# Altium project phone_cover.PrjPcb
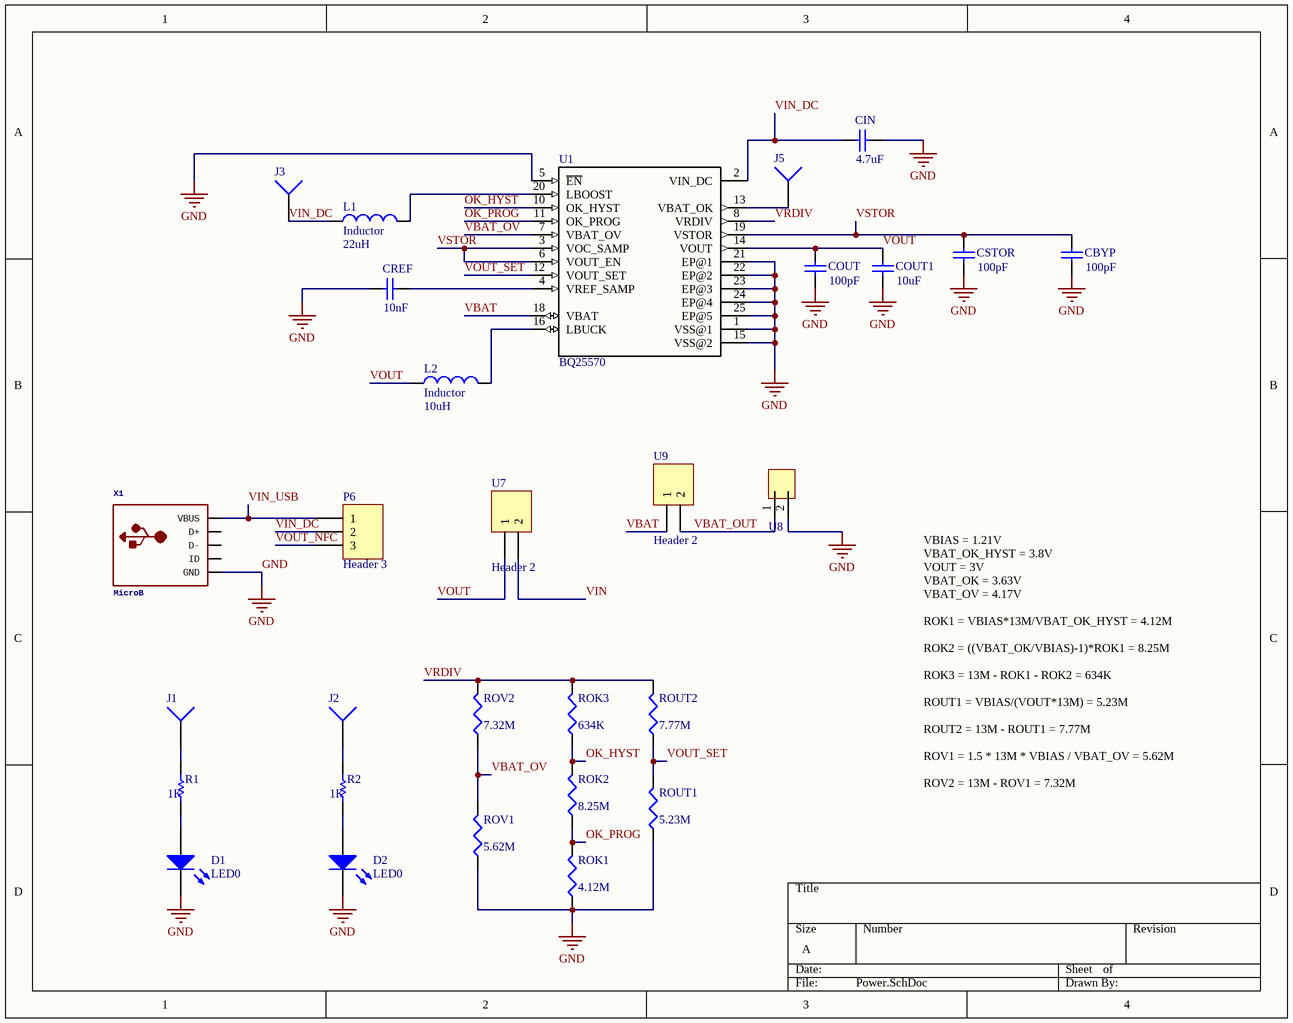
[diagram p0: Power.SchDoc]
3 sheets, 76 parts. Net scope: global (net labels, ports and power ports of the same name join across sheets).
Board file: phone_cover_layout.PcbDoc
Sheets:
  Power.SchDoc
  MCU.SchDoc
  Peripherals.SchDoc

## Sheet Power.SchDoc
size A

### Parts
CBYP  value 100pF  [C1206]  (hidden comment: Cap Semi)
CIN  value 4.7uF  [C1206]  (hidden comment: Cap Semi)
COUT  value 100pF  [C1206]  (hidden comment: Cap Semi)
COUT1  value 10uF  [C1206]  (hidden comment: Cap Semi)
CREF  value 10nF  [C1206]  (hidden comment: Cap Semi)
CSTOR  value 100pF  [C1206]  (hidden comment: Cap Semi)
D1  LED0  [LED-0]
D2  LED0  [LED-0]
J1  Socket  [PIN1]  (value not drawn)
J2  Socket  [PIN1]  (value not drawn)
J3  Socket  [PIN1]  (value not drawn)
J5  Socket  [PIN1]  (value not drawn)
L1  Inductor  value 22uH  [0402-A]
L2  Inductor  value 10uH  [0402-A]
P6  Header 3  [HDR1X3]
R1  value 1K  [AXIAL-0.3]  (hidden comment: Res1)
R2  value 1K  [AXIAL-0.3]  (hidden comment: Res1)
ROK1  value 4.12M  [J1-0603]  (hidden comment: Res3)
ROK2  value 8.25M  [J1-0603]  (hidden comment: Res3)
ROK3  value 634K  [J1-0603]  (hidden comment: Res3)
ROUT1  value 5.23M  [J1-0603]  (hidden comment: Res3)
ROUT2  value 7.77M  [J1-0603]  (hidden comment: Res3)
ROV1  value 5.62M  [J1-0603]  (hidden comment: Res3)
ROV2  value 7.32M  [J1-0603]  (hidden comment: Res3)
U1  BQ25570  [QFN50P350X350X100-21N]
U7  Header 2  [HDR1X2]
U8  JST_Conn  [JST]  (value not drawn)
U9  Header 2  [HDR1X2]
X1  MicroB  [629105150921]

### Nets
GND: CBYP.1 CIN.2 COUT.1 COUT1.1 CREF.1 CSTOR.1 D1.2(K) D2.2(K) ROK1.1 ROUT1.1 ROV1.1 U1.1(VSS@1) U1.5(~{EN}) U1.15(VSS@2) U1.21(EP@1) U1.22(EP@2) U1.23(EP@3) U1.24(EP@4) U1.25(EP@5) U8.2 X1.5(GND)
OK_HYST: ROK2.2 ROK3.1 U1.10(OK_HYST)
OK_PROG: ROK1.2 ROK2.1 U1.11(OK_PROG)
VBAT: U1.18(VBAT) U9.1
VBAT_OUT: U8.1 U9.2
VBAT_OV: ROV1.2 ROV2.1 U1.7(VBAT_OV)
VIN: U7.2  [project net IOVDD_0]
VIN_DC: CIN.1 J3.1 L1.1 P6.2 U1.2(VIN_DC)
VIN_USB: P6.1 X1.1(VBUS)
VOUT: COUT.2 COUT1.2 L2.1 U1.14(VOUT) U7.1
VOUT_NFC: P6.3
VOUT_SET: ROUT1.2 ROUT2.1 U1.12(VOUT_SET)
VRDIV: ROK3.2 ROUT2.2 ROV2.2 U1.8(VRDIV)
VSTOR: CBYP.2 CSTOR.2 U1.3(VOC_SAMP) U1.6(VOUT_EN) U1.19(VSTOR)
NetCREF_2: CREF.2 U1.4(VREF_SAMP)
NetD1_1: D1.1(A) R1.1
NetD2_1: D2.1(A) R2.1
NetJ1_1: J1.1 R1.2
NetJ2_1: J2.1 R2.2
NetJ5_1: J5.1 U1.13(VBAT_OK)
NetL1_2: L1.2 U1.20(LBOOST)
NetL2_2: L2.2 U1.16(LBUCK)

Not connected (* = marked no-connect by the designer): X1 2(D+) 3(D-) 4(ID)

### Notes on the sheet
- VBIAS = 1.21V
  VBAT_OK_HYST = 3.8V
  VOUT = 3V
  VBAT_OK = 3.63V
  VBAT_OV = 4.17V
  ROK1 = VBIAS*13M/VBAT_OK_HYST = 4.12M
  ROK2 = ((VBAT_OK/VBIAS)-1)*ROK1 = 8.25M
  ROK3 = 13M - ROK1 - ROK2 = 634K
  ROUT1 = VBIAS/(VOUT*13M) = 5.23M
  ROUT2 = 13M - ROUT1 = 7.77M
  ROV1 = 1.5 * 13M * VBIAS / VBAT_OV = 5.62M
  ROV2 = 13M - ROV1 = 7.32M

### Library data of the parts
CBYP COUT CSTOR = Cap Semi: CAP CER 100PF 50V C0G/NPO 0603; Manufacturer: Yageo; Manufacturer Part Number: CC0603JRNPO9BN101; Digi-Key Part Number: 311-1069-1-ND
CIN = Cap Semi: CAP CER 4.7UF 10V X5R 0603; Manufacturer: Samsung Electro-Mechanics; Manufacturer Part Number: CL10A475MP5LNNC; Digi-Key Part Number: 1276-6684-1-ND
COUT1 = Cap Semi: CL10A106MQ8NNNC; Manufacturer: Samsung Electro-Mechanics; Digi-Key Part Number: 1276-1119-1-ND; Manufacturer Part Number: CL10A106MQ8NNNC
CREF = Cap Semi: CAP CER 10000PF 100V X7R 0603; Manufacturer: TDK Corporation; Manufacturer Part Number: C1608X7R2A103M080AA; Digi-Key Part Number: 445-1305-1-ND
D1 D2 = LED0: LED BLUE CLEAR CHIP SMD; Manufacturer: Kingbright; Manufacturer Part Number: APT1608QBC/D; Digi-Key Part Number: 754-1434-1-ND
L1 = Inductor: FIXED IND 22UH 510MA 450 MOHM; Manufacturer: Wurth Electronics Inc.; Manufacturer Part Number: 744031220; Digi-Key Part Number: 732-1012-1-ND
L2 = Inductor: FIXED IND 10UH 1A 460 MOHM SMD; Manufacturer: Murata Electronics North America; Manufacturer Part Number: 1239AS-H-100M=P2; Digi-Key Part Number: 490-10563-1-ND
P6 = Header 3: Header, 3-Pin; LatestRevisionDate: 17-Jul-2002; LatestRevisionNote: Re-released for DXP Platform.; Publisher: Altium Limited
R1 R2 = Res1: RES SMD 1K OHM 0.5% 1/16W 0603; Manufacturer: Susumu; Manufacturer Part Number: RR0816P-102-D; Digi-Key Part Number: RR08P1.0KDCT-ND
ROK1 = Res3: RES SMD 4.12M OHM 1% 1/10W 0603; Manufacturer Part Number: CRCW06034M12FKEA; Manufacturer: Vishay Dale; Digi-Key Part Number: 541-4.12MHCT-ND
ROK2 = Res3: RES SMD 8.25M OHM 1% 1/10W 0603; Manufacturer: Vishay Dale; Manufacturer Part Number: CRCW06038M25FKEA; Digi-Key Part Number: 541-8.25MHCT-ND
ROK3 = Res3: RES SMD 634K OHM 1% 1/10W 0603; Manufacturer: Yageo; Manufacturer Part Number: RC0603FR-07634KL; Digi-Key Part Number: 311-634KHRCT-ND
ROUT1 = Res3: RES SMD 5.23M OHM 1% 1/10W 0603; Manufacturer: Vishay Dale; Manufacturer Part Number: CRCW06035M23FKEA; Digi-Key Part Number: 541-5.23MHCT-ND
ROUT2 = Res3: RES SMD 7.68M OHM 1% 1/10W 0603; Manufacturer: Vishay Dale; Manufacturer Part Number: CRCW06037M68FKEA; Digi-Key Part Number: 541-7.68MHCT-ND
ROV1 = Res3: RES 5.62M OHM 1% 1/10W 0603; Manufacturer: Stackpole Electronics Inc.; Manufacturer Part Number: RMCF0603FT5M62; Digi-Key Part Number: RMCF0603FT5M62CT-ND
ROV2 = Res3: RES 7.32M OHM 1% 1/10W 0603; Manufacturer: Stackpole Electronics Inc.; Manufacturer Part Number: RMCF0603FT7M32; Digi-Key Part Number: RMCF0603FT7M32CT-ND
U1 = BQ25570RGRR: IC ENERGY HARV CTRLR BATT 20VQFN; Manufacturer: Texas Instruments; Digi-Key Part Number: 296-39934-1-ND; Manufacturer Part Number: BQ25570RGRR; DatasheetLink: http://www.ti.com/lit/ds/symlink/bq25570.pdf
U7 U9 = Header 2: Header, 2-Pin; LatestRevisionDate: 17-Jul-2002; LatestRevisionNote: Re-released for DXP Platform.; Publisher: Altium Limited
X1 = USBMICRO_20329: CONN RCPT STD MICRO USB TYPE B; Manufacturer: Amphenol FCI; ManufacturerPartNo: 10103594-0001LF; ComponentLink1Description: Datasheet; ComponentLink1URL: http://cdn.amphenol-icc.com/media/wysiwyg/files/documentation/datasheet/inputoutput/io_usb_micro.pdf; Supplier: Digi-Key; SupplierPartNo: 609-4050-1-ND; SupplierLink1URL: https://www.digikey.com/product-detail/en/amphenol-fci/10103594-0001LF/609-4050-1-ND/2350357
J1-J3 J5 = Socket: LatestRevisionDate: 17-Jul-2002; LatestRevisionNote: Re-released for DXP Platform.; Publisher: Altium Limited

## Sheet MCU.SchDoc
size A
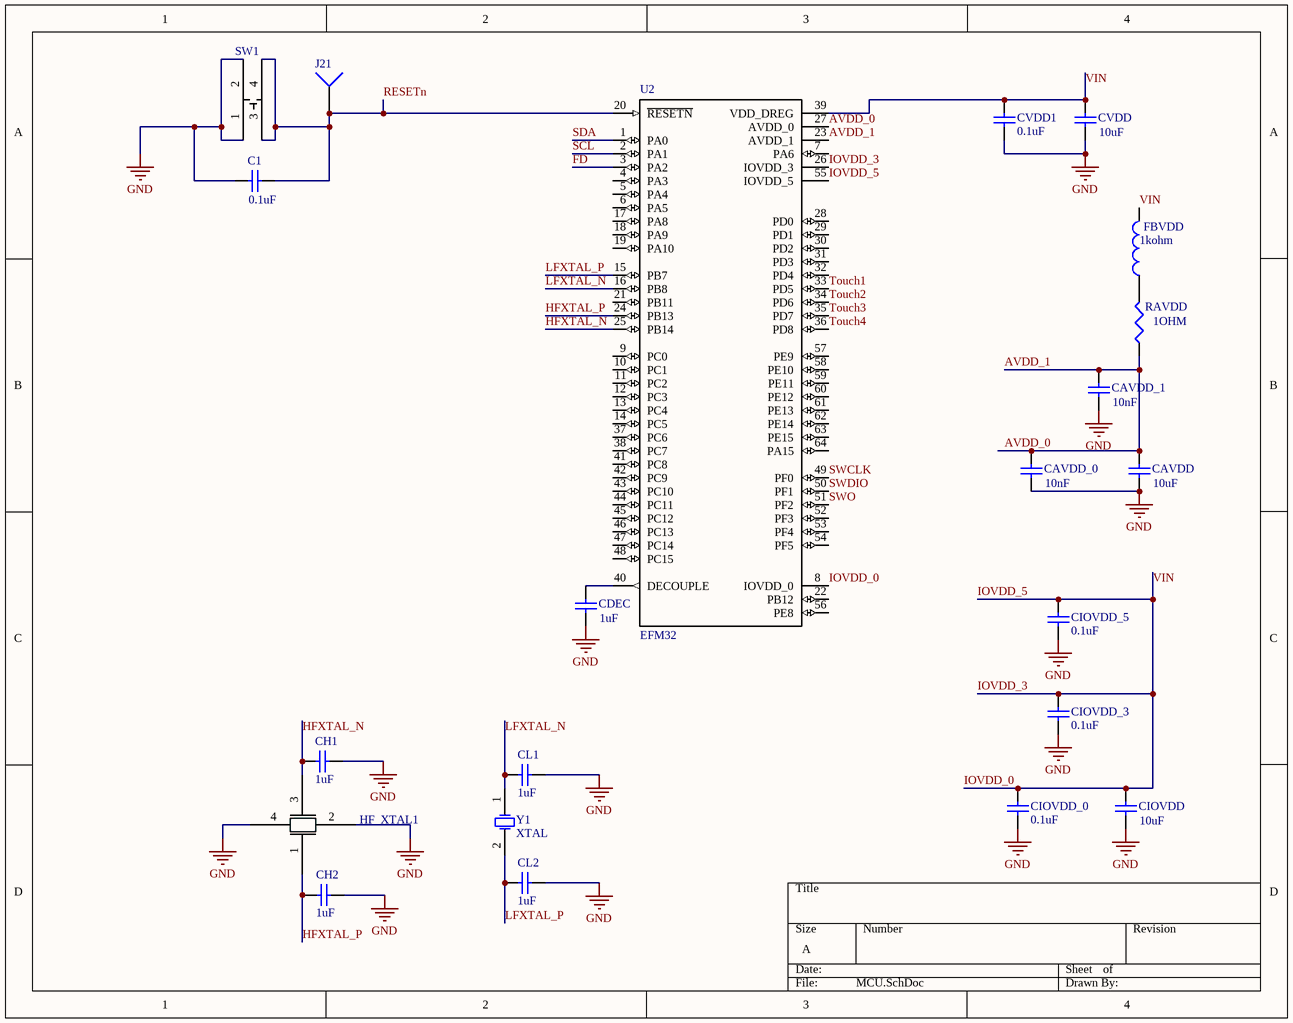
[diagram p1: MCU.SchDoc]

### Parts
C1  value 0.1uF  [C1206]  (hidden comment: Cap Semi)
CAVDD  value 10uF  [C1206]  (hidden comment: Cap Semi)
CAVDD_0  value 10nF  [C1206]  (hidden comment: Cap Semi)
CAVDD_1  value 10nF  [C1206]  (hidden comment: Cap Semi)
CDEC  value 1uF  [C1206]  (hidden comment: Cap Semi)
CH1  value 1uF  [C1206]  (hidden comment: Cap Semi)
CH2  value 1uF  [C1206]  (hidden comment: Cap Semi)
CIOVDD  value 10uF  [C1206]  (hidden comment: Cap Semi)
CIOVDD_0  value 0.1uF  [C1206]  (hidden comment: Cap Semi)
CIOVDD_3  value 0.1uF  [C1206]  (hidden comment: Cap Semi)
CIOVDD_5  value 0.1uF  [C1206]  (hidden comment: Cap Semi)
CL1  value 1uF  [C1206]  (hidden comment: Cap Semi)
CL2  value 1uF  [C1206]  (hidden comment: Cap Semi)
CVDD  value 10uF  [C1206]  (hidden comment: Cap Semi)
CVDD1  value 0.1uF  [C1206]  (hidden comment: Cap Semi)
FBVDD  value 1kohm  [0402-A]  (hidden comment: Inductor)
HF_XTAL1  Crystal_OSC  [HFXTAL]  (value not drawn)
J21  Socket  [PIN1]  (value not drawn)
RAVDD  value 1OHM  [J1-0603]  (hidden comment: Res3)
SW1  Switch-PTS645  [Switch]  (value not drawn)
U2  EFM32  [QFN-64]
Y1  XTAL  [R38]

### Nets
GND: C1.1 CAVDD.1 CAVDD_0.1 CAVDD_1.1 CDEC.1 CH1.1 CH2.1 CIOVDD.1 CIOVDD_0.1 CIOVDD_3.1 CIOVDD_5.1 CL1.1 CL2.2 CVDD.1 CVDD1.1 HF_XTAL1.2 HF_XTAL1.4 SW1.1 SW1.2
AVDD_0: CAVDD.2 CAVDD_0.2 CAVDD_1.2 RAVDD.1 U2.23(AVDD_1) U2.27(AVDD_0)  [also labelled AVDD_1]
FD: U2.3(PA2)
HFXTAL_N: CH1.2 HF_XTAL1.3 U2.25(PB14)
HFXTAL_P: CH2.2 HF_XTAL1.1 U2.24(PB13)
IOVDD_0: CIOVDD.2 CIOVDD_0.2 CIOVDD_3.2 CIOVDD_5.2 CVDD.2 CVDD1.2 FBVDD.2 U2.8(IOVDD_0) U2.26(IOVDD_3) U2.39(VDD_DREG) U2.55(IOVDD_5)  [also labelled IOVDD_3, IOVDD_5, VIN]
LFXTAL_N: CL1.2 U2.16(PB8) Y1.1(OSC1)
LFXTAL_P: CL2.1 U2.15(PB7) Y1.2(OSC2)
RESETn: C1.2 J21.1 SW1.3 SW1.4 U2.20(~{RESETN})
SCL: U2.2(PA1)
SDA: U2.1(PA0)
SWCLK: U2.49(PF0)
SWDIO: U2.50(PF1)
SWO: U2.51(PF2)
Touch1: U2.33(PD5)
Touch2: U2.34(PD6)
Touch3: U2.35(PD7)
Touch4: U2.36(PD8)
NetCDEC_2: CDEC.2 U2.40(DECOUPLE)
NetFBVDD_1: FBVDD.1 RAVDD.2

Not connected (* = marked no-connect by the designer): U2 4(PA3) 5(PA4) 6(PA5) 7(PA6) 9(PC0) 10(PC1) 11(PC2) 12(PC3) 13(PC4) 14(PC5) 17(PA8) 18(PA9) 19(PA10) 21(PB11) 22(PB12) 28(PD0) 29(PD1) 30(PD2) 31(PD3) 32(PD4) 37(PC6) 38(PC7) 41(PC8) 42(PC9) 43(PC10) 44(PC11) 45(PC12) 46(PC13) 47(PC14) 48(PC15) 52(PF3) 53(PF4) 54(PF5) 56(PE8) 57(PE9) 58(PE10) 59(PE11) 60(PE12) 61(PE13) 62(PE14) 63(PE15) 64(PA15)

### Library data of the parts
C1 CIOVDD_0 CIOVDD_3 CIOVDD_5 CVDD1 = Cap Semi: CAP CER 0.1UF 16V Y5V 0603; Manufacturer: Samsung Electro-Mechanics; Manufacturer Part Number: CL10F104ZO8NNNC; Digi-Key Part Number: 1276-1258-1-ND
CAVDD CIOVDD CVDD = Cap Semi: as COUT1 on sheet Power; Digi-Key Part Number: 1276-1119-1-ND; Manufacturer Part Number: CL10A106MQ8NNNC
CAVDD_0 CAVDD_1 = Cap Semi: as CREF on sheet Power; Digi-Key Part Number: 445-1305-1-ND
CDEC CH1 CH2 CL1 CL2 = Cap Semi: CAP CER 1UF 16V X7R 0603; Manufacturer: Samsung Electro-Mechanics; Manufacturer Part Number: CL10B105MO8NNWC; Digi-Key Part Number: 1276-6524-1-ND
FBVDD = Inductor: FERRITE BEAD 1 KOHM 0603 1LN; Manufacturer: Wurth Electronics Inc.; Manufacturer Part Number: 74279266; Digi-Key Part Number: 732-4484-1-ND
HF_XTAL1 = Crystal_OSC: Manufacturer: Kyocera International Inc. Electronic Components; Manufacturer Part Number: CX2016DB40000D0FLJCC; Digi-Key Part Number: 1253-1120-1-ND; Component URL: https://media.digikey.com/pdf/Data%20Sheets/Optrex%20PDFs/CX2016DB_Series_Spec.pdf; Component URL Description: Datasheet
RAVDD = Res3: RES SMD 1 OHM 1% 1/10W 0603; Manufacturer: Yageo; Manufacturer Part Number: RC0603FR-071RL; Digi-Key Part Number: 311-1.00HRCT-ND
SW1 = Switch-PTS645: SWITCH TACTILE SPST-NO 0.05A 12V; Manufacturer: C&K; Manufacturer Part Number: PTS645SM43SMTR92 LFS; Digi-Key Part Number: CKN9112CT-ND; Component URL: http://www.ckswitches.com/media/1471/pts645.pdf; Component URL Description: Datasheet
U2 = EFM32G232F128-QFP64: IC MCU 32BIT 64KB FLASH 64QFN; Manufacturer: Silicon Labs; Manufacturer Part Number: EFM32LG840F64G-E-QFN64R; Digi-Key Part Number: 336-4841-1-ND
Y1 = XTAL: CRYSTAL 32.7680KHZ 7PF SMD; Manufacturer: Abracon LLC; Manufacturer Part Number: ABS07-32.768KHZ-7-T; Digi-Key Part Number: 535-9543-1-ND; DatasheetLink: https://abracon.com/Resonators/ABS07.pdf
J21 = Socket: LatestRevisionDate: 17-Jul-2002; LatestRevisionNote: Re-released for DXP Platform.; Publisher: Altium Limited

## Sheet Peripherals.SchDoc
size A
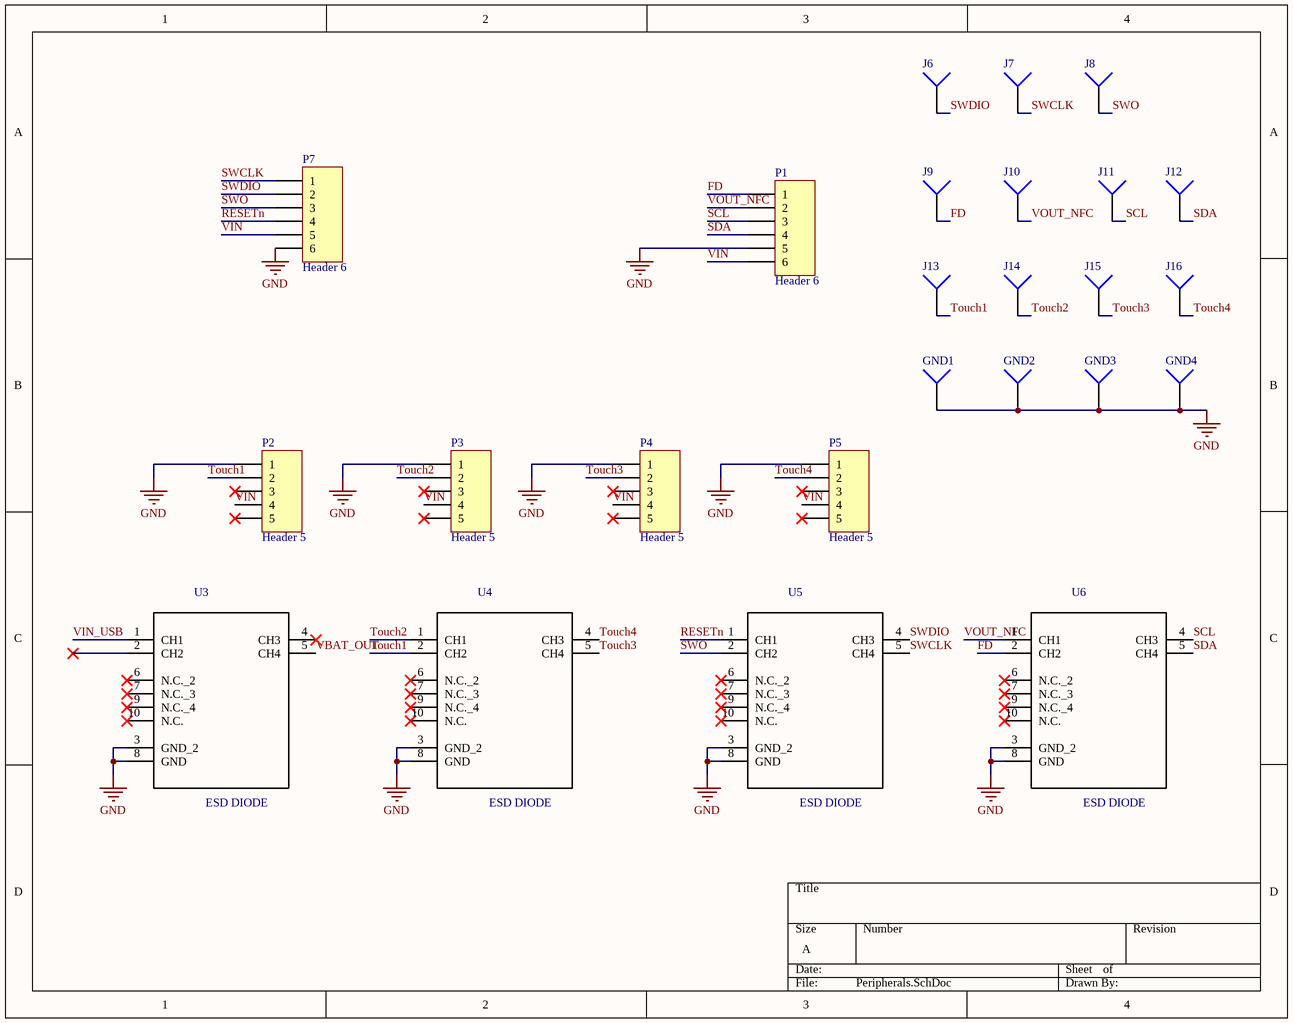
[diagram p2: Peripherals.SchDoc]

### Parts
GND1  Socket  [PIN1]  (value not drawn)
GND2  Socket  [PIN1]  (value not drawn)
GND3  Socket  [PIN1]  (value not drawn)
GND4  Socket  [PIN1]  (value not drawn)
J6  Socket  [PIN1]  (value not drawn)
J7  Socket  [PIN1]  (value not drawn)
J8  Socket  [PIN1]  (value not drawn)
J9  Socket  [PIN1]  (value not drawn)
J10  Socket  [PIN1]  (value not drawn)
J11  Socket  [PIN1]  (value not drawn)
J12  Socket  [PIN1]  (value not drawn)
J13  Socket  [PIN1]  (value not drawn)
J14  Socket  [PIN1]  (value not drawn)
J15  Socket  [PIN1]  (value not drawn)
J16  Socket  [PIN1]  (value not drawn)
P1  Header 6  [HDR1X6]
P2  Header 5  [HDR1X5]
P3  Header 5  [HDR1X5]
P4  Header 5  [HDR1X5]
P5  Header 5  [HDR1X5]
P7  Header 6  [HDR1X6]
U3  ESD DIODE  [SON50P100X255X50-10N]
U4  ESD DIODE  [SON50P100X255X50-10N]
U5  ESD DIODE  [SON50P100X255X50-10N]
U6  ESD DIODE  [SON50P100X255X50-10N]

### Nets
GND: GND1.1 GND2.1 GND3.1 GND4.1 P1.5 P2.1 P3.1 P4.1 P5.1 P7.6 U3.3(GND_2) U3.8(GND) U4.3(GND_2) U4.8(GND) U5.3(GND_2) U5.8(GND) U6.3(GND_2) U6.8(GND)
FD: J9.1 P1.1 U6.2(CH2)
RESETn: P7.4 U5.1(CH1)
SCL: J11.1 P1.3 U6.4(CH3)
SDA: J12.1 P1.4 U6.5(CH4)
SWCLK: J7.1 P7.1 U5.5(CH4)
SWDIO: J6.1 P7.2 U5.4(CH3)
SWO: J8.1 P7.3 U5.2(CH2)
Touch1: J13.1 P2.2 U4.2(CH2)
Touch2: J14.1 P3.2 U4.1(CH1)
Touch3: J15.1 P4.2 U4.5(CH4)
Touch4: J16.1 P5.2 U4.4(CH3)
VBAT_OUT: U3.5(CH4)
VIN: P1.6 P2.4 P3.4 P4.4 P5.4 P7.5  [project net IOVDD_0]
VIN_USB: U3.1(CH1)
VOUT_NFC: J10.1 P1.2 U6.1(CH1)

Not connected (* = marked no-connect by the designer): P2 3* 5*; P3 3* 5*; P4 3* 5*; P5 3* 5*; U3 2(CH2)* 4(CH3)* 6(N.C._2)* 7(N.C._3)* 9(N.C._4)* 10(N.C.)*; U4 6(N.C._2)* 7(N.C._3)* 9(N.C._4)* 10(N.C.)*; U5 6(N.C._2)* 7(N.C._3)* 9(N.C._4)* 10(N.C.)*; U6 6(N.C._2)* 7(N.C._3)* 9(N.C._4)* 10(N.C.)*

### Library data of the parts
P1 P7 = Header 6: Header, 6-Pin; LatestRevisionDate: 17-Jul-2002; LatestRevisionNote: Re-released for DXP Platform.; Publisher: Altium Limited
P2-P5 = Header 5: Header, 5-Pin; LatestRevisionDate: 17-Jul-2002; LatestRevisionNote: Re-released for DXP Platform.; Publisher: Altium Limited
U3-U6 = IP4292CZ10-TBR: TVS DIODE DFN2510A-10; Manufacturer: Nexperia USA Inc.; Manufacturer Part Number: PHDMI2FR4Z; Digi-Key Part Number: 1727-7821-1-ND; DatasheetLink: https://assets.nexperia.com/documents/data-sheet/PHDMI2FR4.pdf
GND1-GND4 J6-J16 = Socket: LatestRevisionDate: 17-Jul-2002; LatestRevisionNote: Re-released for DXP Platform.; Publisher: Altium Limited

## Nets that join several sheets
GND: Power (21 pins), MCU (19 pins), Peripherals (18 pins)
FD: MCU (U2.3), Peripherals (J9.1 P1.1 U6.2)
IOVDD_0: Power (U7.2), MCU (11 pins), Peripherals (6 pins)
RESETn: MCU (5 pins), Peripherals (P7.4 U5.1)
SCL: MCU (U2.2), Peripherals (J11.1 P1.3 U6.4)
SDA: MCU (U2.1), Peripherals (J12.1 P1.4 U6.5)
SWCLK: MCU (U2.49), Peripherals (J7.1 P7.1 U5.5)
SWDIO: MCU (U2.50), Peripherals (J6.1 P7.2 U5.4)
SWO: MCU (U2.51), Peripherals (J8.1 P7.3 U5.2)
Touch1: MCU (U2.33), Peripherals (J13.1 P2.2 U4.2)
Touch2: MCU (U2.34), Peripherals (J14.1 P3.2 U4.1)
Touch3: MCU (U2.35), Peripherals (J15.1 P4.2 U4.5)
Touch4: MCU (U2.36), Peripherals (J16.1 P5.2 U4.4)
VBAT_OUT: Power (U8.1 U9.2), Peripherals (U3.5)
VIN_USB: Power (P6.1 X1.1), Peripherals (U3.1)
VOUT_NFC: Power (P6.3), Peripherals (J10.1 P1.2 U6.1)